# Altium project LedMatrix.PrjPcb
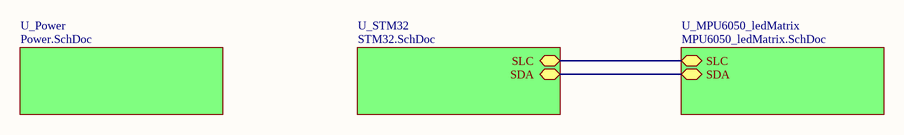
[diagram p0: main.SchDoc]
4 sheets, 36 parts. Net scope: hierarchical (ports join the sheet entries above them; power ports are global).
Board file: PCB_main.PcbDoc
Sheets:
  main.SchDoc
    U_Power = Power.SchDoc
    U_MPU6050_ledMatrix = MPU6050_ledMatrix.SchDoc
    U_STM32 = STM32.SchDoc

## Sheet main.SchDoc
size A4; SheetNumber: 1; SheetTotal: 4

### Sub-sheets
U_MPU6050_ledMatrix = MPU6050_ledMatrix.SchDoc: SDA (bidir), SLC (bidir)
U_Power = Power.SchDoc: no entries
U_STM32 = STM32.SchDoc: SLC (bidir), SDA (bidir)

### Nets
NetIC1_29: sheet U_MPU6050_ledMatrix/SLC, sheet U_STM32/SLC
NetIC1_30: sheet U_MPU6050_ledMatrix/SDA, sheet U_STM32/SDA

## Sheet Power.SchDoc
size A4; SheetNumber: 4; SheetTotal: 4
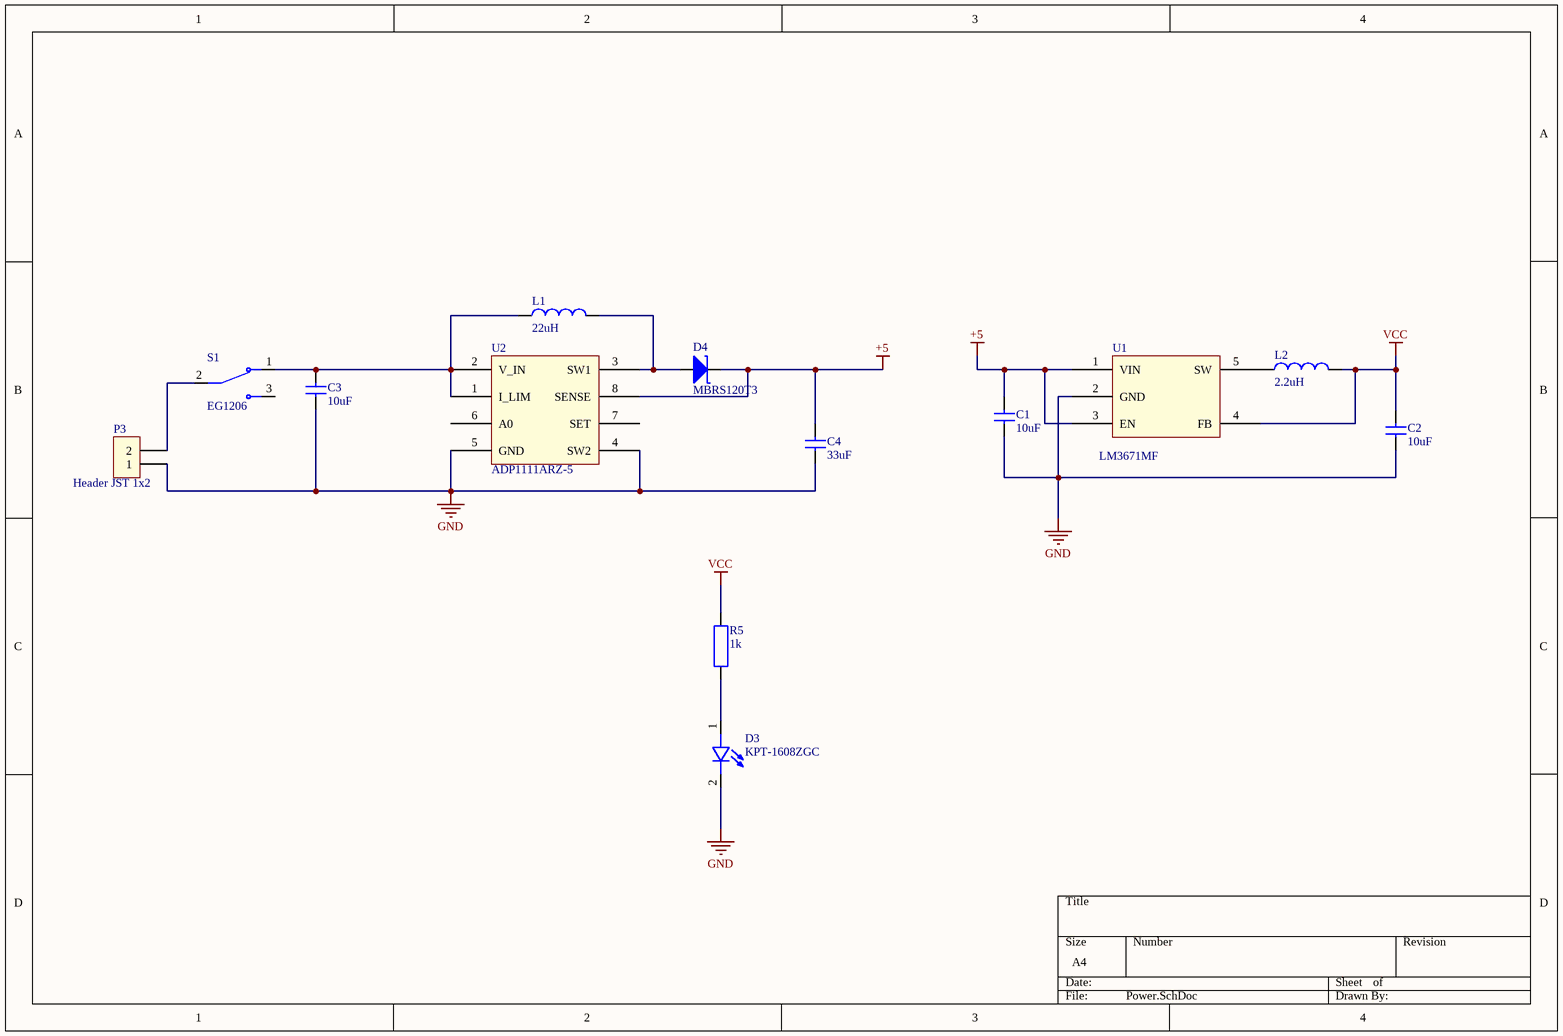
[diagram p1: Power.SchDoc]

### Parts
C1  10uF  [SMD_CAPACITOR_1206]
C2  10uF  [SMD_CAPACITOR_1206]
C3  value 10uF  [SMD_CAPACITOR_1206]  (hidden comment: 100nF)
C4  value 33uF  [SMD_CAPACITOR_1206]  (hidden comment: 100nF)
D3  KPT-1608ZGC  [LED_KPT-1608ZGC]
D4  MBRS120T3  [SMD_DO-214AC]
L1  22uH  [SMD_INDUCTOR_7.3MM]
L2  value 2.2uH  [SMD_INDUCTOR_0805]  (hidden comment: 22uH)
P3  Header JST 1x2  [THT_HEADER_78MIL_JST_1X2_MALE]
R5  1k  [SMD_RESISTOR_1206]
S1  EG1206  [SW_EG1206]
U1  LM3671MF  [SMD_SOT-23-5]
U2  ADP1111ARZ-5  [SMD_SOIC-8]

### Nets
+5: C1.2 C4.2 D4.2 U1.1(VIN) U1.3(EN) U2.8(SENSE)
GND: C1.1 C2.2 C3.2 C4.1 D3.2(C) P3.1 U1.2(GND) U2.4(SW2) U2.5(GND)
VCC: C2.1 L2.2 R5.1 U1.4(FB)
NetC3_1: C3.1 L1.1 S1.1 U2.1(I_LIM) U2.2(V_IN)
NetD3_1: D3.1(A) R5.2
NetD4_1: D4.1 L1.2 U2.3(SW1)
NetL2_1: L2.1 U1.5(SW)
NetP3_2: P3.2 S1.2

Not connected (* = marked no-connect by the designer): S1 3; U2 6(A0) 7(SET)

### Library data of the parts
C1-C4 = Capacitor: 0805: http://cz.farnell.com/webapp/wcs/stores/servlet/Search?catalogId=15001&langId=420&storeId=10156&categoryId=700000005423&sort=P_PRICE&pageSize=100&beginIndex=1&showResults=true&sf=502,707&pf=1010141074,1012080068,1012245578; 1206: http://cz.farnell.com/webapp/wcs/stores/servlet/Search?catalogId=15001&langId=420&storeId=10156&categoryId=700000005423&sort=P_PRICE&pageSize=100&beginIndex=1&showResults=true&sf=502,707&pf=1012245584
  C1 C2: Value: 10uF
D3 = KPT-1608ZGC: 1.6x0.8mm Smd Chip Led Lamp; MF: Kingbright; Value: *; SnapEDA_Link: https://www.snapeda.com/parts/KPT-1608ZGC/Kingbright/view-part/?ref=snap; Availability: In Stock; Price: None; Package: 0603 Kingbright; Check_prices: https://www.snapeda.com/parts/KPT-1608ZGC/Kingbright/view-part/?ref=eda; MP: KPT-1608ZGC
D4 = Diode_Schottky: Diode Schottky; DO-214AC: http://cz.farnell.com/webapp/wcs/stores/servlet/Search?catalogId=15001&langId=420&storeId=10156&categoryId=700000043508&sort=P_PRICE&pageSize=100&showResults=true&sf=502,707&pf=1010199473; SOD-123: http://cz.farnell.com/webapp/wcs/stores/servlet/Search?catalogId=15001&langId=420&storeId=10156&categoryId=700000043508&sort=P_PRICE&pageSize=100&showResults=true&sf=502,707&pf=1010130987; Value: MBRS120T3
L1 L2 = Inductor: 0805: http://cz.farnell.com/webapp/wcs/stores/servlet/Search?catalogId=15001&langId=420&storeId=10156&categoryId=700000005466&sort=P_PRICE&pageSize=100&showResults=true&sf=502,707&pf=1012244717,1012248439; 7.3MM: http://cz.farnell.com/webapp/wcs/stores/servlet/Search?catalogId=15001&langId=420&storeId=10156&categoryId=700000005463&sort=P_PRICE&pageSize=100&showResults=true&sf=502,707&pf=1012026164,1012026165,1012026166,1012026167,1012026168,1012026169,1012026170,1012244724
  L1: Value: 22uH
P3 = Header_JST_1x2
R5 = Resistor: 1206: http://cz.farnell.com/webapp/wcs/stores/servlet/Search?catalogId=15001&langId=420&storeId=10156&categoryId=700000005450&pageSize=100&showResults=true&sf=502,707&pf=1012211755; 0805: http://cz.farnell.com/webapp/wcs/stores/servlet/Search?catalogId=15001&langId=420&storeId=10156&categoryId=700000005450&sort=P_PRICE&pageSize=100&showResults=true&sf=502,707&pf=1012211743; Value: 1k
U1 = LM3671MF: Step Down Switching Regulator, Fixed, 2.7V-5.5V Input, 3.3V and 0.6A Output; Link: http://cz.farnell.com/texas-instruments/lm36713-3-nopb/ic-step-down-dc-dc-converter-5/dp/1685767; Value: LM3671MF
U2 = ADP1111ARZ-5: Buck, Boost Switching Regulator, Fixed, 2V-30V Input, 5V and 1.5A Output; Link: http://cz.farnell.com/analog-devices/adp1111arz-5/v-reg-step-up-down-5v-smd-soic8/dp/1439044; Value: ADP1111ARZ-5
S1 = EG1206: Value: *; Package: None; Price: None; MP: EG1206; Availability: Unavailable

## Sheet MPU6050_ledMatrix.SchDoc
size A4; SheetNumber: 3; SheetTotal: 4
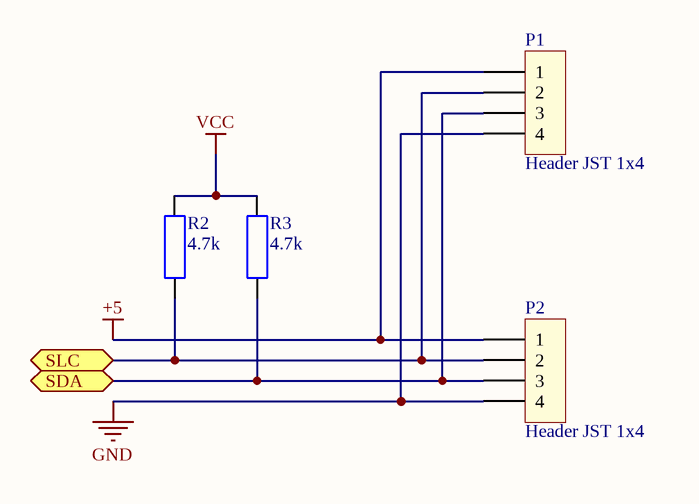
[diagram p2: MPU6050_ledMatrix.SchDoc]

### Parts
P1  Header JST 1x4  [THT_HEADER_78MIL_JST_1X4_MALE]
P2  Header JST 1x4  [THT_HEADER_78MIL_JST_1X4_MALE]
R2  4.7k  [SMD_RESISTOR_1206]
R3  4.7k  [SMD_RESISTOR_1206]

### Ports
SDA (bidir), SLC (bidir)

### Nets
+5: P1.1 P2.1
GND: P1.4 P2.4
VCC: R2.1 R3.1
NetIC1_29: P1.2 P2.2 R2.2 ; port SLC
NetIC1_30: P1.3 P2.3 R3.2 ; port SDA

### Library data of the parts
P1 P2 = Header_JST_1x4
R2 R3 = Resistor: 1206: http://cz.farnell.com/webapp/wcs/stores/servlet/Search?catalogId=15001&langId=420&storeId=10156&categoryId=700000005450&pageSize=100&showResults=true&sf=502,707&pf=1012211755; 0805: http://cz.farnell.com/webapp/wcs/stores/servlet/Search?catalogId=15001&langId=420&storeId=10156&categoryId=700000005450&sort=P_PRICE&pageSize=100&showResults=true&sf=502,707&pf=1012211743; Value: 4.7k

## Sheet STM32.SchDoc
size A4; SheetNumber: 2; SheetTotal: 4
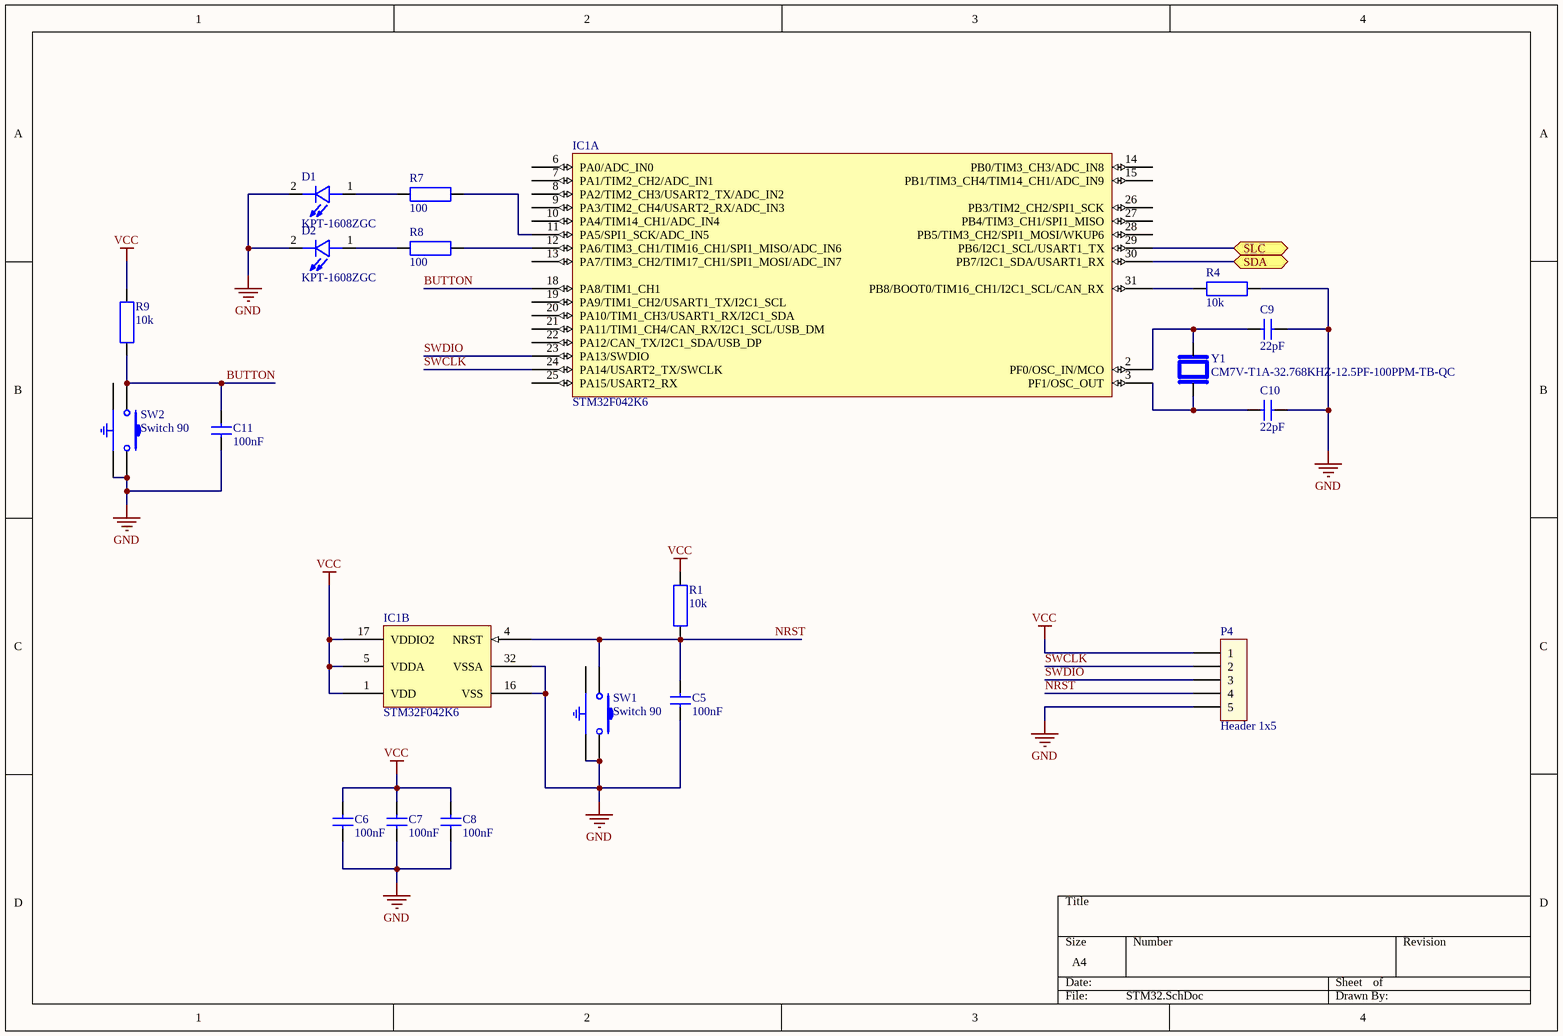
[diagram p3: STM32.SchDoc]

### Parts
C5  100nF  [SMD_CAPACITOR_1206]
C6  100nF  [SMD_CAPACITOR_1206]
C7  100nF  [SMD_CAPACITOR_1206]
C8  100nF  [SMD_CAPACITOR_1206]
C9  22pF  [SMD_CAPACITOR_1206]
C10  22pF  [SMD_CAPACITOR_1206]
C11  100nF  [SMD_CAPACITOR_1206]
D1  KPT-1608ZGC  [LED_KPT-1608ZGC]
D2  KPT-1608ZGC  [LED_KPT-1608ZGC]
IC1  STM32F042K6  [SMD_LQFP-32]  (parts A,B of 2)
P4  Header 1x5  [THT_HEADER_100MIL_1X5_MALE_90]
R1  10k  [SMD_RESISTOR_1206]
R4  10k  [SMD_RESISTOR_1206]
R7  100  [SMD_RESISTOR_1206]
R8  100  [SMD_RESISTOR_1206]
R9  10k  [SMD_RESISTOR_1206]
SW1  Switch 90  [SMD_SWITCH_SPST_90]
SW2  Switch 90  [SMD_SWITCH_SPST_90]
Y1  CM7V-T1A-32.768KHZ-12.5PF-100PPM-TB-QC  [XTAL_CM7V-T1A-32.768KHZ-12.5PF-100PPM-TB-QC]

### Ports
SDA (bidir), SLC (bidir)

### Nets
GND: C5.2 C6.1 C7.1 C8.2 C9.2 C10.2 C11.2 D1.2(C) D2.2(C) IC1.16(VSS) IC1.32(VSSA) P4.5 R4.2 SW1.2 SW1.4 SW2.2 SW2.4
VCC: C6.2 C7.2 C8.1 IC1.1(VDD) IC1.5(VDDA) IC1.17(VDDIO2) P4.1 R1.1 R9.1
BUTTON: C11.1 IC1.18(PA8/TIM1_CH1) R9.2 SW2.1
NRST: C5.1 IC1.4(NRST) P4.4 R1.2 SW1.1
SWCLK: IC1.24(PA14/USART2_TX/SWCLK) P4.2
SWDIO: IC1.23(PA13/SWDIO) P4.3
NetC9_1: C9.1 IC1.2(PF0/OSC_IN/MCO) Y1.1
NetC10_1: C10.1 IC1.3(PF1/OSC_OUT) Y1.2
NetD1_1: D1.1(A) R7.1
NetD2_1: D2.1(A) R8.1
NetIC1_11: IC1.11(PA5/SPI1_SCK/ADC_IN5) R7.2
NetIC1_12: IC1.12(PA6/TIM3_CH1/TIM16_CH1/SPI1_MISO/ADC_IN6) R8.2
NetIC1_29: IC1.29(PB6/I2C1_SCL/USART1_TX) ; port SLC
NetIC1_30: IC1.30(PB7/I2C1_SDA/USART1_RX) ; port SDA
NetIC1_31: IC1.31(PB8/BOOT0/TIM16_CH1/I2C1_SCL/CAN_RX) R4.1

Not connected (* = marked no-connect by the designer): IC1 6(PA0/ADC_IN0) 7(PA1/TIM2_CH2/ADC_IN1) 8(PA2/TIM2_CH3/USART2_TX/ADC_IN2) 9(PA3/TIM2_CH4/USART2_RX/ADC_IN3) 10(PA4/TIM14_CH1/ADC_IN4) 13(PA7/TIM3_CH2/TIM17_CH1/SPI1_MOSI/ADC_IN7) 14(PB0/TIM3_CH3/ADC_IN8) 15(PB1/TIM3_CH4/TIM14_CH1/ADC_IN9) 19(PA9/TIM1_CH2/USART1_TX/I2C1_SCL) 20(PA10/TIM1_CH3/USART1_RX/I2C1_SDA) 21(PA11/TIM1_CH4/CAN_RX/I2C1_SCL/USB_DM) 22(PA12/CAN_TX/I2C1_SDA/USB_DP) 25(PA15/USART2_RX) 26(PB3/TIM2_CH2/SPI1_SCK) 27(PB4/TIM3_CH1/SPI1_MISO) 28(PB5/TIM3_CH2/SPI1_MOSI/WKUP6); SW1 3; SW2 3

### Library data of the parts
C5-C11 = Capacitor: 0805: http://cz.farnell.com/webapp/wcs/stores/servlet/Search?catalogId=15001&langId=420&storeId=10156&categoryId=700000005423&sort=P_PRICE&pageSize=100&beginIndex=1&showResults=true&sf=502,707&pf=1010141074,1012080068,1012245578; 1206: http://cz.farnell.com/webapp/wcs/stores/servlet/Search?catalogId=15001&langId=420&storeId=10156&categoryId=700000005423&sort=P_PRICE&pageSize=100&beginIndex=1&showResults=true&sf=502,707&pf=1012245584
  C5-C8 C11: Value: 100nF
  C9 C10: Value: 22pF
D1 D2 = KPT-1608ZGC: as D3 on sheet Power; Value: *; SnapEDA_Link: https://www.snapeda.com/parts/KPT-1608ZGC/Kingbright/view-part/?ref=snap; Availability: In Stock; Price: None; Package: 0603 Kingbright; Check_prices: https://www.snapeda.com/parts/KPT-1608ZGC/Kingbright/view-part/?ref=eda; MP: KPT-1608ZGC
IC1 = STM32F042K6: ARM Cortex-M0 32-bit MCU, 6 KB Internal RAM, 32 KB Flash, 48 MHz, 32-pin LQFP; Link: http://cz.farnell.com/stmicroelectronics/stm32f042k6t7/mcu-32bit-cortex-m0-48mhz-lqfp/dp/2469553; Value: STM32F042K6
P4 = Header_1x5
R1 R4 R7-R9 = Resistor: 1206: http://cz.farnell.com/webapp/wcs/stores/servlet/Search?catalogId=15001&langId=420&storeId=10156&categoryId=700000005450&pageSize=100&showResults=true&sf=502,707&pf=1012211755; 0805: http://cz.farnell.com/webapp/wcs/stores/servlet/Search?catalogId=15001&langId=420&storeId=10156&categoryId=700000005450&sort=P_PRICE&pageSize=100&showResults=true&sf=502,707&pf=1012211743
  R1 R4 R9: Value: 10k
  R7: Value: 100
  R8: Value: 100; Parameter 1: *
SW1 SW2 = Switch_90: Tactile Switch Right Angle; SMD_SPST_90: http://www.gme.cz/p-phap-3355r-p630-286; THT_SPST_90: http://cz.farnell.com/alps/skhhlqa010/switch-tactile-6x6mm-horiz-blk/dp/2056827
Y1 = CM7V-T1A-32.768KHZ-12.5PF-100PPM-TB-QC: LOW FREQUENCY CRYSTAL; MF: Micro Crystal; Package: SMD-2 Micro Crystal; SnapEDA_Link: https://www.snapeda.com/parts/CM7V-T1A-32.768kHz-12.5pF-100PPM-TB-QC/Micro+Crystal/view-part/?ref=snap; Value: *; MP: CM7V-T1A-32.768kHz-12.5pF-100PPM-TB-QC; Availability: In Stock; Price: None; Purchase-URL: https://pricing.snapeda.com/search/part/CM7V-T1A-32.768kHz-12.5pF-100PPM-TB-QC/?ref=eda; Check_prices: https://www.snapeda.com/parts/CM7V-T1A-32.768kHz-12.5pF-100PPM-TB-QC/Micro+Crystal/view-part/?ref=eda

## Nets that join several sheets
+5: Power (6 pins), MPU6050_ledMatrix (P1.1 P2.1)
GND: Power (9 pins), MPU6050_ledMatrix (P1.4 P2.4), STM32 (17 pins)
VCC: Power (C2.1 L2.2 R5.1 U1.4), MPU6050_ledMatrix (R2.1 R3.1), STM32 (9 pins)
NetIC1_29: MPU6050_ledMatrix (P1.2 P2.2 R2.2), STM32 (IC1.29)
NetIC1_30: MPU6050_ledMatrix (P1.3 P2.3 R3.2), STM32 (IC1.30)